# Altium schematic sheet FPGA_51_Countdown.SchDoc: LiveDesign Evaluation - Countdown
size A3; Organization: Altium Limited; Address1: L3, 12a Rodborough Rd; Address2: Frenchs Forest; Address3: NSW; Address4: Australia 2086; DocumentNumber: 1; SheetNumber: 1; SheetTotal: 11
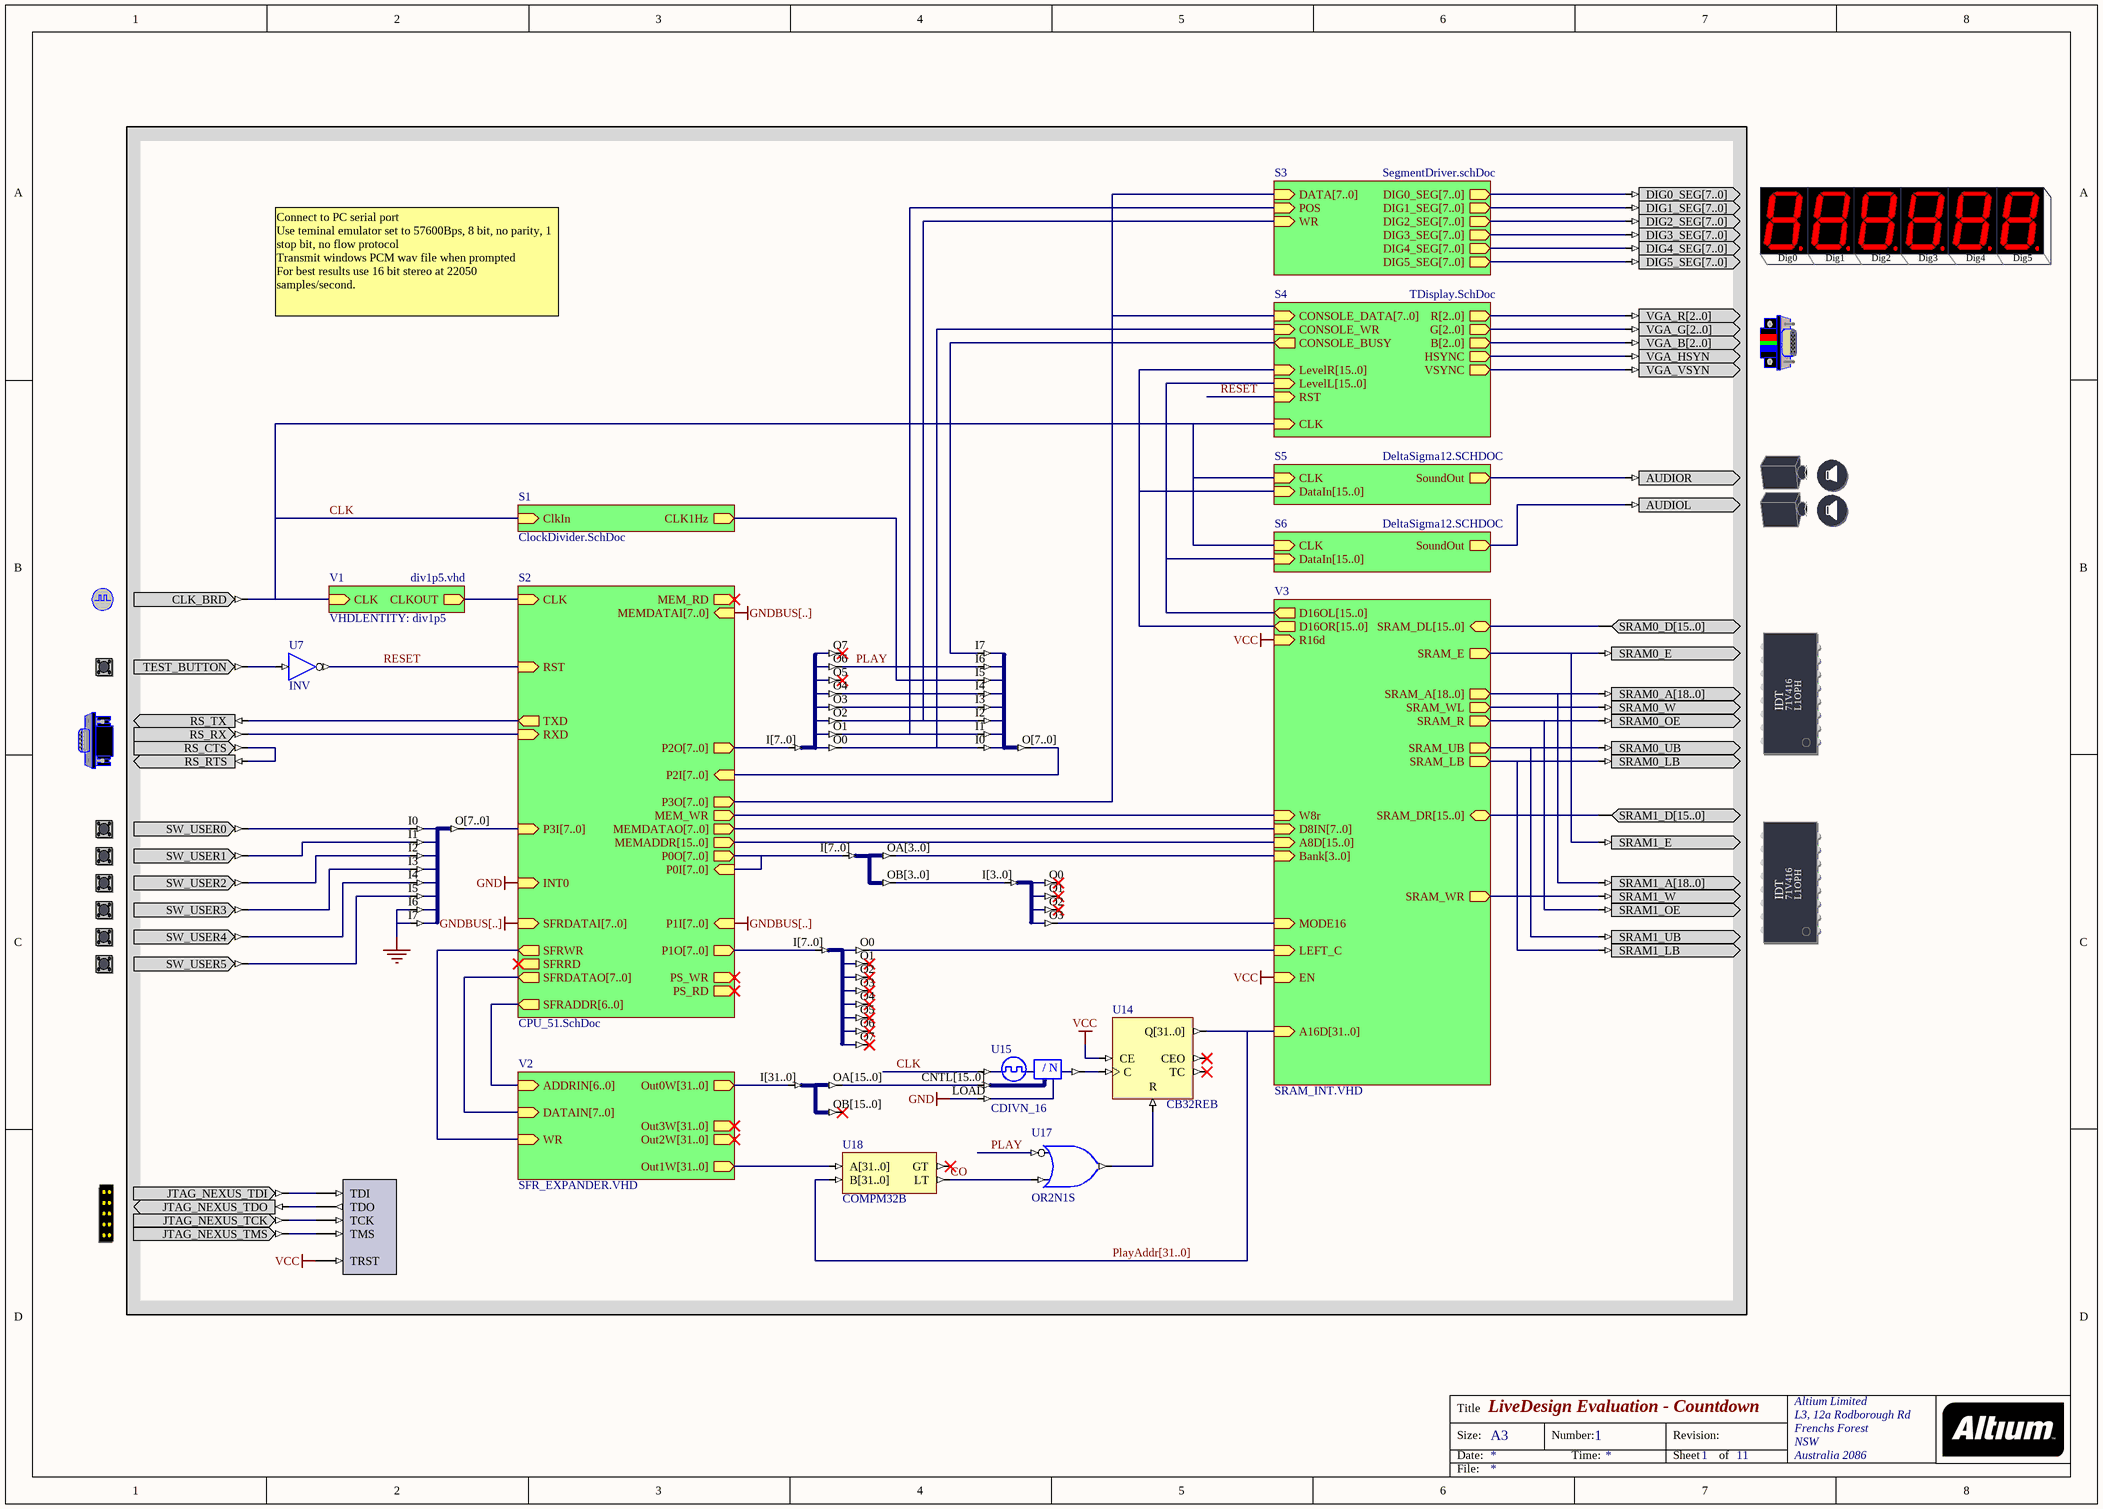
[diagram p0: FPGA_51_Countdown.SchDoc]

## Parts
(Parts that share a designator on the sheet are numbered #1, #2 ... from top to bottom, then left to right.)
?#1  VGACNTR  (value not drawn)
?#2  STEREO  (value not drawn)
?#3  NEXUS_JTAG_CONNECTOR  (value not drawn)
NEXUS_JTAG_PORT  NEXUS_JTAG_PORT  (value not drawn)
U7  INV
U8  J8B_8S  (value not drawn)
U9  J8B_8S  (value not drawn)
U10  J8S_8B  (value not drawn)
U11  J8S_8B  (value not drawn)
U12  J8B_4B2  (value not drawn)
U13  J4B_4S  (value not drawn)
U14  CB32REB
U15  CDIVN_16
U16  J32B_16B2  (value not drawn)
U17  OR2N1S
U18  COMPM32B
U?#1  7SEGX6  (value not drawn)
U?#2  CLOCK_BOARD  (value not drawn)
U?#3  SRAM_DAUGHTER0  (value not drawn)
U?#4  TEST_BUTTON  (value not drawn)
U?#5  RS232CNTR  (value not drawn)
U?#6  SRAM_DAUGHTER1  (value not drawn)
U?#7  USER_BUTTONX6  (value not drawn)

## Sub-sheets
S1 = ClockDivider.SchDoc: ClkIn (in), CLK1Hz (out)
S2 = CPU_51.SchDoc: CLK (in), RXD (in), TXD (out), MEMADDR[15..0] (out), MEM_WR (out), MEM_RD (out), SFRDATAO[7..0] (out), SFRDATAI[7..0] (in), SFRWR (out), SFRRD (out), SFRADDR[6..0] (out), INT0 (in), P1O[7..0] (out), P1I[7..0] (in), MEMDATAO[7..0] (out), MEMDATAI[7..0] (in), PS_WR (out), PS_RD (out), P2O[7..0] (out), P0O[7..0] (out), P0I[7..0] (in), P2I[7..0] (in), P3O[7..0] (out), P3I[7..0] (in), RST (in)
S3 = SegmentDriver.schDoc: DATA[7..0] (in), POS (in), WR (in), DIG0_SEG[7..0] (out), DIG1_SEG[7..0] (out), DIG2_SEG[7..0] (out), DIG3_SEG[7..0] (out), DIG4_SEG[7..0] (out), DIG5_SEG[7..0] (out)
S4 = TDisplay.SchDoc: CLK (in), HSYNC (out), VSYNC (out), R[2..0] (out), G[2..0] (out), B[2..0] (out), CONSOLE_WR (in), CONSOLE_DATA[7..0] (in), CONSOLE_BUSY (out), RST (in), LevelR[15..0] (in), LevelL[15..0] (in)
S5 = DeltaSigma12.SCHDOC: CLK (in), DataIn[15..0] (in), SoundOut (out)
S6 = DeltaSigma12.SCHDOC: CLK (in), DataIn[15..0] (in), SoundOut (out)
V1 = div1p5.vhd: CLK (in), CLKOUT (out)  | VHDLENTITY: div1p5
V2 = SFR_EXPANDER.VHD: ADDRIN[6..0] (in), DATAIN[7..0] (in), Out0W[31..0] (out), WR (in), Out2W[31..0] (out), Out3W[31..0] (out), Out1W[31..0] (out)  | VHDLENTITY: SFR_EXPANDER
V3 = SRAM_INT.VHD: SRAM_DL[15..0] (bidir), SRAM_E (out), SRAM_A[18..0] (out), SRAM_WL (out), SRAM_R (out), SRAM_UB (out), SRAM_LB (out), Bank[3..0] (in), W8r (in), D8IN[7..0] (in), A8D[15..0] (in), D16OL[15..0] (out), R16d (in), A16D[31..0] (in), MODE16 (in), EN (in), D16OR[15..0] (out), SRAM_DR[15..0] (bidir), SRAM_WR (out), LEFT_C (in)

## Nets
GND: U11.I6 U11.I7 U15.LOAD ; sheet S2/INT0
VCC: NEXUS_JTAG_PORT.TRST U14.CE ; sheet V3/R16d, sheet V3/EN
CLK: U15.CLKIN U?#2.CLK_BRD ; sheet S6/CLK, sheet S5/CLK, sheet S1/ClkIn, sheet S4/CLK, sheet V1/CLK
CO: U17.I1 U18.LT
PLAY: U8.O6 U10.I6 U17.I0
PlayAddr[31..0]: U14.Q[31..0] U18.B[31..0] ; sheet V3/A16D[31..0]
RESET: U7.O ; sheet S2/RST, sheet S4/RST
Net?#1_VGA_B[2..0]: ?#1.VGA_B[2..0] ; sheet S4/B[2..0]
Net?#1_VGA_G[2..0]: ?#1.VGA_G[2..0] ; sheet S4/G[2..0]
Net?#1_VGA_HSYN: ?#1.VGA_HSYN ; sheet S4/HSYNC
Net?#1_VGA_R[2..0]: ?#1.VGA_R[2..0] ; sheet S4/R[2..0]
Net?#1_VGA_VSYN: ?#1.VGA_VSYN ; sheet S4/VSYNC
Net?#2_AUDIOL: ?#2.AUDIOL ; sheet S6/SoundOut
Net?#2_AUDIOR: ?#2.AUDIOR ; sheet S5/SoundOut
Net?#3_JTAG_NEXUS_TCK: ?#3.JTAG_NEXUS_TCK NEXUS_JTAG_PORT.TCK
Net?#3_JTAG_NEXUS_TDI: ?#3.JTAG_NEXUS_TDI NEXUS_JTAG_PORT.TDI
Net?#3_JTAG_NEXUS_TDO: ?#3.JTAG_NEXUS_TDO NEXUS_JTAG_PORT.TDO
Net?#3_JTAG_NEXUS_TMS: ?#3.JTAG_NEXUS_TMS NEXUS_JTAG_PORT.TMS
NetU7_I: U7.I U?#4.TEST_BUTTON
NetU8_I[7..0]: U8.I[7..0] ; sheet S2/P2O[7..0]
NetU8_O0: U8.O0 U10.I0 ; sheet S4/CONSOLE_WR
NetU8_O1: U8.O1 U10.I1 ; sheet S3/POS
NetU8_O2: U8.O2 U10.I2 ; sheet S3/WR
NetU8_O3: U8.O3 U10.I3
NetU8_O4: U8.O4 U10.I4
NetU9_I[7..0]: U9.I[7..0] ; sheet S2/P1O[7..0]
NetU9_O0: U9.O0 ; sheet V3/LEFT_C
NetU10_I5: U10.I5 ; sheet S1/CLK1Hz
NetU10_I7: U10.I7 ; sheet S4/CONSOLE_BUSY
NetU10_O[7..0]: U10.O[7..0] ; sheet S2/P2I[7..0]
NetU11_I0: U11.I0 U?#7.SW_USER0
NetU11_I1: U11.I1 U?#7.SW_USER1
NetU11_I2: U11.I2 U?#7.SW_USER2
NetU11_I3: U11.I3 U?#7.SW_USER3
NetU11_I4: U11.I4 U?#7.SW_USER4
NetU11_I5: U11.I5 U?#7.SW_USER5
NetU11_O[7..0]: U11.O[7..0] ; sheet S2/P3I[7..0]
NetU12_I[7..0]: U12.I[7..0] ; sheet S2/P0O[7..0], sheet S2/P0I[7..0]
NetU12_OA[3..0]: U12.OA[3..0] ; sheet V3/Bank[3..0]
NetU12_OB[3..0]: U12.OB[3..0] U13.I[3..0]
NetU13_O3: U13.O3 ; sheet V3/MODE16
NetU14_C: U14.C U15.CLKDV
NetU14_R: U14.R U17.O
NetU15_CNTL[15..0]: U15.CNTL[15..0] U16.OA[15..0]
NetU16_I[31..0]: U16.I[31..0] ; sheet V2/Out0W[31..0]
NetU18_A[31..0]: U18.A[31..0] ; sheet V2/Out1W[31..0]
NetU?#1_DIG0_SEG[7..0]: U?#1.DIG0_SEG[7..0] ; sheet S3/DIG0_SEG[7..0]
NetU?#1_DIG1_SEG[7..0]: U?#1.DIG1_SEG[7..0] ; sheet S3/DIG1_SEG[7..0]
NetU?#1_DIG2_SEG[7..0]: U?#1.DIG2_SEG[7..0] ; sheet S3/DIG2_SEG[7..0]
NetU?#1_DIG3_SEG[7..0]: U?#1.DIG3_SEG[7..0] ; sheet S3/DIG3_SEG[7..0]
NetU?#1_DIG4_SEG[7..0]: U?#1.DIG4_SEG[7..0] ; sheet S3/DIG4_SEG[7..0]
NetU?#1_DIG5_SEG[7..0]: U?#1.DIG5_SEG[7..0] ; sheet S3/DIG5_SEG[7..0]
NetU?#3_SRAM0_A[18..0]: U?#3.SRAM0_A[18..0] U?#6.SRAM1_A[18..0] ; sheet V3/SRAM_A[18..0]
NetU?#3_SRAM0_D[15..0]: U?#3.SRAM0_D[15..0] ; sheet V3/SRAM_DL[15..0]
NetU?#3_SRAM0_E: U?#3.SRAM0_E U?#6.SRAM1_E ; sheet V3/SRAM_E
NetU?#3_SRAM0_LB: U?#3.SRAM0_LB U?#6.SRAM1_LB ; sheet V3/SRAM_LB
NetU?#3_SRAM0_OE: U?#3.SRAM0_OE U?#6.SRAM1_OE ; sheet V3/SRAM_R
NetU?#3_SRAM0_UB: U?#3.SRAM0_UB U?#6.SRAM1_UB ; sheet V3/SRAM_UB
NetU?#3_SRAM0_W: U?#3.SRAM0_W ; sheet V3/SRAM_WL
NetU?#5_RS_CTS: U?#5.RS_CTS U?#5.RS_RTS
NetU?#5_RS_RX: U?#5.RS_RX ; sheet S2/RXD
NetU?#5_RS_TX: U?#5.RS_TX ; sheet S2/TXD
NetU?#6_SRAM1_D[15..0]: U?#6.SRAM1_D[15..0] ; sheet V3/SRAM_DR[15..0]
NetU?#6_SRAM1_W: U?#6.SRAM1_W ; sheet V3/SRAM_WR
(unnamed): sheet S2/CLK, sheet V1/CLKOUT
(unnamed): sheet S2/MEM_WR, sheet V3/W8r
(unnamed): sheet S2/SFRWR, sheet V2/WR

Not connected (* = marked no-connect by the designer): U8 O5* O7*; U9 O1* O2* O3* O4* O5* O6* O7*; U13 O0* O1* O2*; U14 CEO* TC*; U16 OB[15..0]*; U18 GT*

## Buses and harness runs
bus PlayAddr[31..0] = sheet V3/A16D[31..0]
bus sheet S2/MEMADDR[15..0] = sheet V3/A8D[15..0]
bus sheet S2/MEMDATAO[7..0] = sheet V3/D8IN[7..0]
bus sheet S2/P0I[7..0] = sheet S2/P0O[7..0]
bus sheet S2/P3O[7..0] = sheet S3/DATA[7..0] = sheet S4/CONSOLE_DATA[7..0]
bus sheet S2/SFRADDR[6..0] = sheet V2/ADDRIN[6..0]
bus sheet S2/SFRDATAO[7..0] = sheet V2/DATAIN[7..0]
bus sheet S4/LevelL[15..0] = sheet S6/DataIn[15..0] = sheet V3/D16OL[15..0]
bus sheet S4/LevelR[15..0] = sheet S5/DataIn[15..0] = sheet V3/D16OR[15..0]

## Notes on the sheet
- Connect to PC serial port
  Use teminal emulator set to 57600Bps, 8 bit, no parity, 1 stop bit, no flow protocol
  Transmit windows PCM wav file when prompted
  For best results use 16 bit stereo at 22050 samples/second.
- Title
- Size:
- Date:
- A3
- Number:
- Time:
- Revision:
- Sheet
- of
- File:
- (in symbol 7SEGX6) Dig0; Dig1; Dig2; Dig3; Dig4; Dig5
- (in symbol CDIVN_16) / N
- (in symbol SRAM_DAUGHTER0) IDT; 71V416; L1OPH
- (in symbol SRAM_DAUGHTER1) IDT; 71V416; L1OPH

## Library data of the parts
?#1 = VGACNTR: VGA Dsub-15-Female-HD; PortComponent: True; Published: 19-Nov-2003; Publisher: Altium Limited
?#2 = STEREO: Sound interface; PortComponent: True; Published: 19-Nov-2003; Publisher: Altium Limited
?#3 = NEXUS_JTAG_CONNECTOR: JTAG Port; PortComponent: True; Published: 19-Nov-2003; Publisher: Altium Limited
NEXUS_JTAG_PORT = NEXUS_JTAG_PORT: Nexus Processor JTAG Chain Connector; NEXUS_JTAG_CONNECTOR: True; Published: 5-Sep-2003; Publisher: Altium Hobart Technology Centre
U7 = INV: Inverter; ArchiveName: GENERIC; VHDLIB_SIM: GENERIC_LIB; Published: 29-Jan-2004; Publisher: Altium Limited; Xilinx Equivalent: INV; Core Revision: 1.00.00
U8 U9 = J8B_8S: 8-Bit input bus to 8 single pin outputs; ArchiveName: GENERIC; VHDLIB_SIM: GENERIC_LIB; Published: 29-Jan-2004; Publisher: Altium Limited; Core Revision: 1.00.00
U10 U11 = J8S_8B: 8 Single pin inputs to single 8-Bit output bus; ArchiveName: GENERIC; VHDLIB_SIM: GENERIC_LIB; Published: 29-Jan-2004; Publisher: Altium Limited; Core Revision: 1.00.00
U12 = J8B_4B2: 1 x 8-bit input bus to 2 x 4-Bit output bus; ArchiveName: GENERIC; VHDLIB_SIM: GENERIC_LIB; Published: 29-Jan-2004; Publisher: Altium Limited; Core Revision: 1.00.00
U13 = J4B_4S: 4-Bit input bus to 4 Single pin outputs; ArchiveName: GENERIC; VHDLIB_SIM: GENERIC_LIB; Published: 29-Jan-2004; Publisher: Altium Limited; Core Revision: 1.00.00
U14 = CB32REB: 32-Bit Cascadable Binary Counter with Clock Enable and Synchronous Reset, Bus Version; ArchiveName: GENERIC; VHDLIB_SIM: GENERIC_LIB; Published: 31-May-2004; Publisher: Altium Limited; Core Revision: 1.00.00
U15 = CDIVN_16: 16-Bit Programmable Clock Divider; ArchiveName: GENERIC; VHDLIB_SIM: GENERIC_LIB; Published: 29-Jan-2004; Publisher: Altium Limited; Core Revision: 1.00.00
U16 = J32B_16B2: 1 x 32-bit input bus to 2 x 16-Bit output bus; ArchiveName: GENERIC; VHDLIB_SIM: GENERIC_LIB; Published: 29-Jan-2004; Publisher: Altium Limited; Core Revision: 1.00.00
U17 = OR2N1S: 2-Input OR Gate with Active Low A Input, Single Pin Version; ArchiveName: GENERIC; VHDLIB_SIM: GENERIC_LIB; Xilinx Equivalent: OR2B1; Published: 29-Jan-2004; Publisher: Altium Limited; Core Revision: 1.00.00
U18 = COMPM32B: 32-Bit Magnitude Comparator, Bus Version; ArchiveName: GENERIC; VHDLIB_SIM: GENERIC_LIB; Published: 31-May-2004; Publisher: Altium Limited; Core Revision: 1.00.00
U?#1 = 7SEGX6: 6 x 7 Segment display module; PortComponent: True; Publisher: Altium Limited; Published: 9-Sept-2004
U?#2 = CLOCK_BOARD: Global System Clock Supply; PortComponent: True; Published: 19-Nov-2003; Publisher: Altium Limited
U?#3 = SRAM_DAUGHTER0: SRAM - 0 Module - Daughterboard; PortComponent: True; Published: 13-May-2004; Publisher: Altium Limited
U?#4 = TEST_BUTTON: Test Button; PortComponent: True; Published: 19-Nov-2003; Publisher: Altium Limited
U?#5 = RS232CNTR: DCE Serial Port Connector; PortComponent: True; Published: 19-Nov-2003; Publisher: Altium Limited
U?#6 = SRAM_DAUGHTER1: SRAM - 1 Module - Daughterboard; PortComponent: True; Published: 13-May-2004; Publisher: Altium Limited
U?#7 = USER_BUTTONX6: User Buttons; PortComponent: True; Published: 19-Nov-2003; Publisher: Altium Limited